# EAGLE schematic PWR1 (EAGLE 4.16)
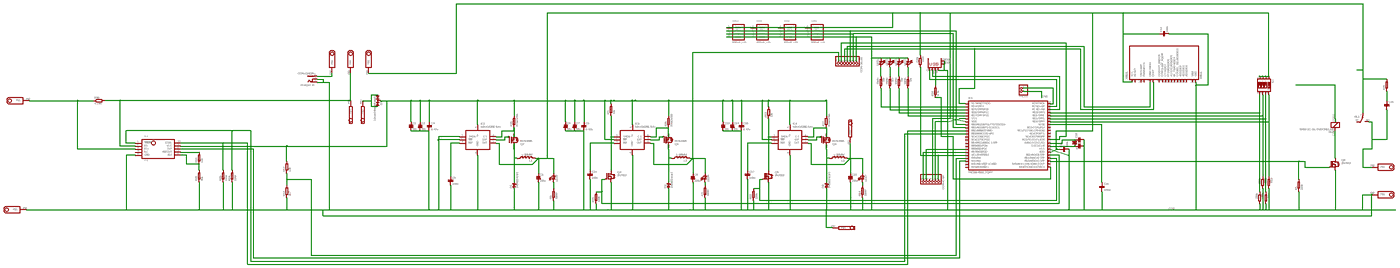
[diagram p0: schematic, sheet 1, overview]
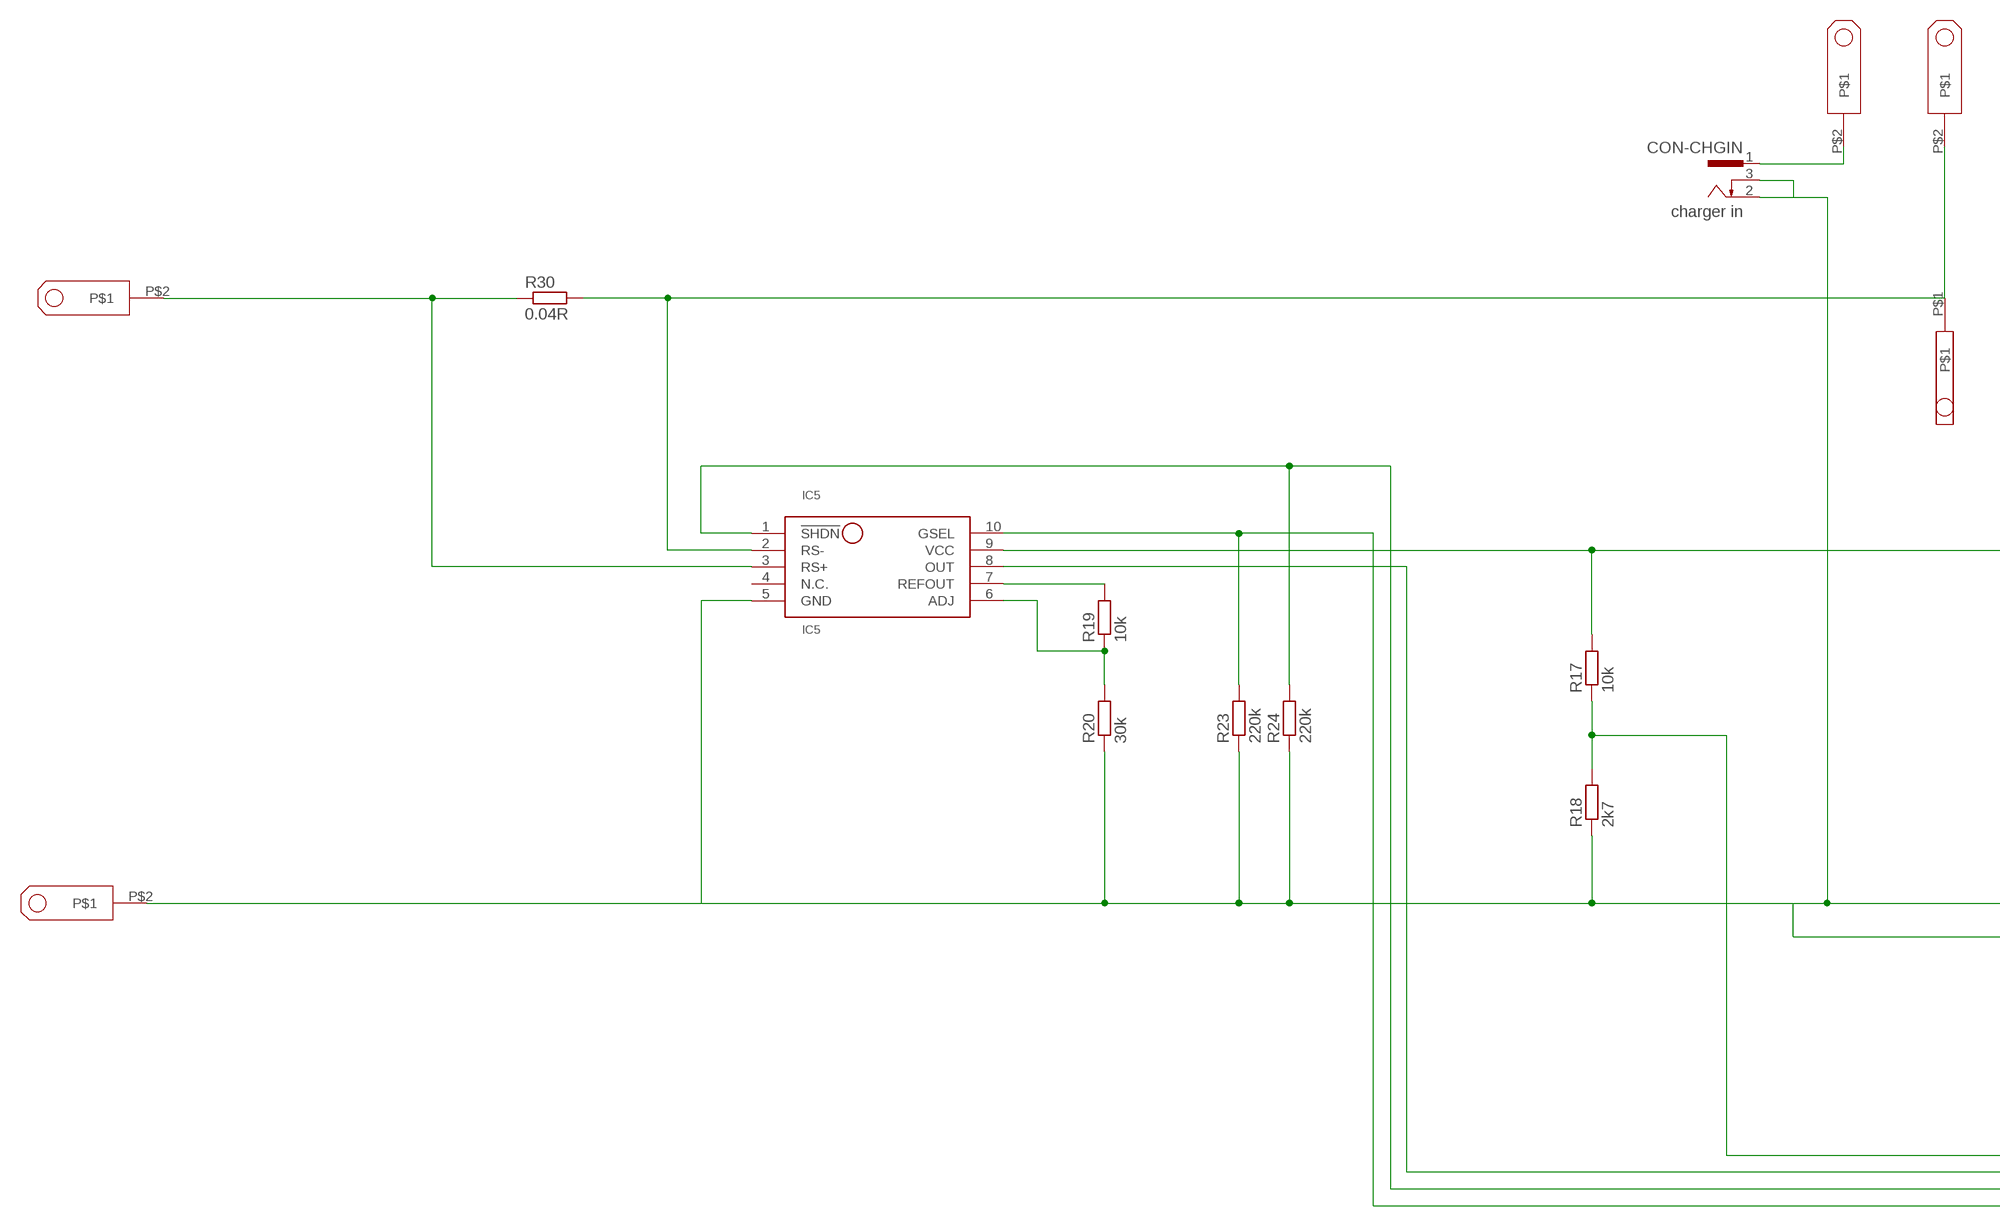
[diagram p1: schematic, sheet 1, part 1 of 4]
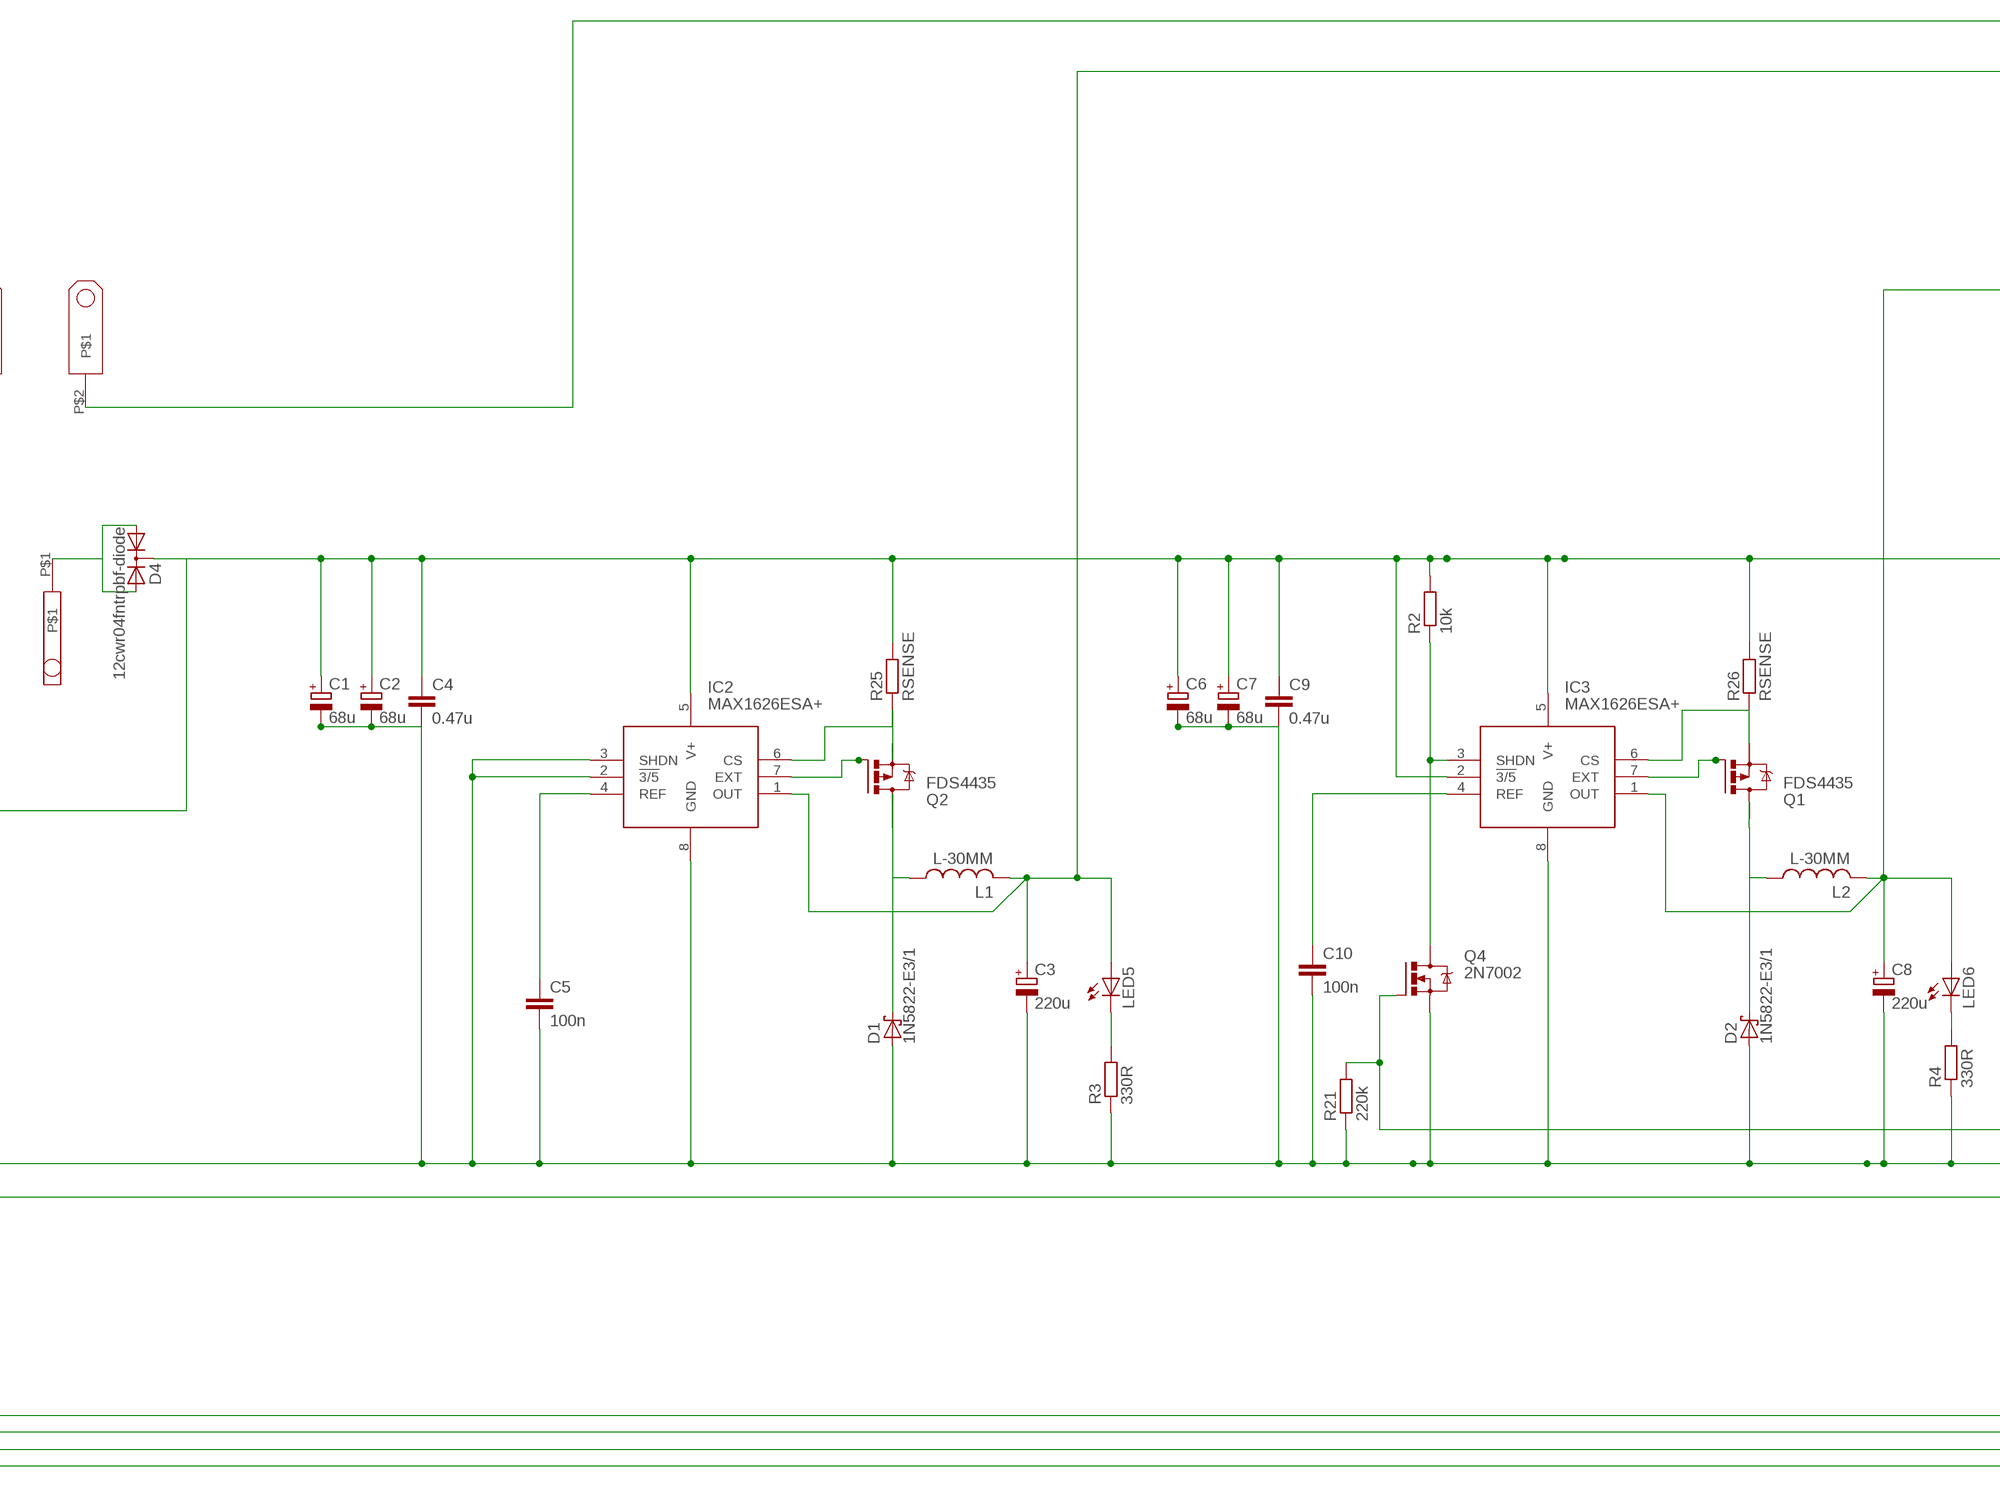
[diagram p2: schematic, sheet 1, part 2 of 4]
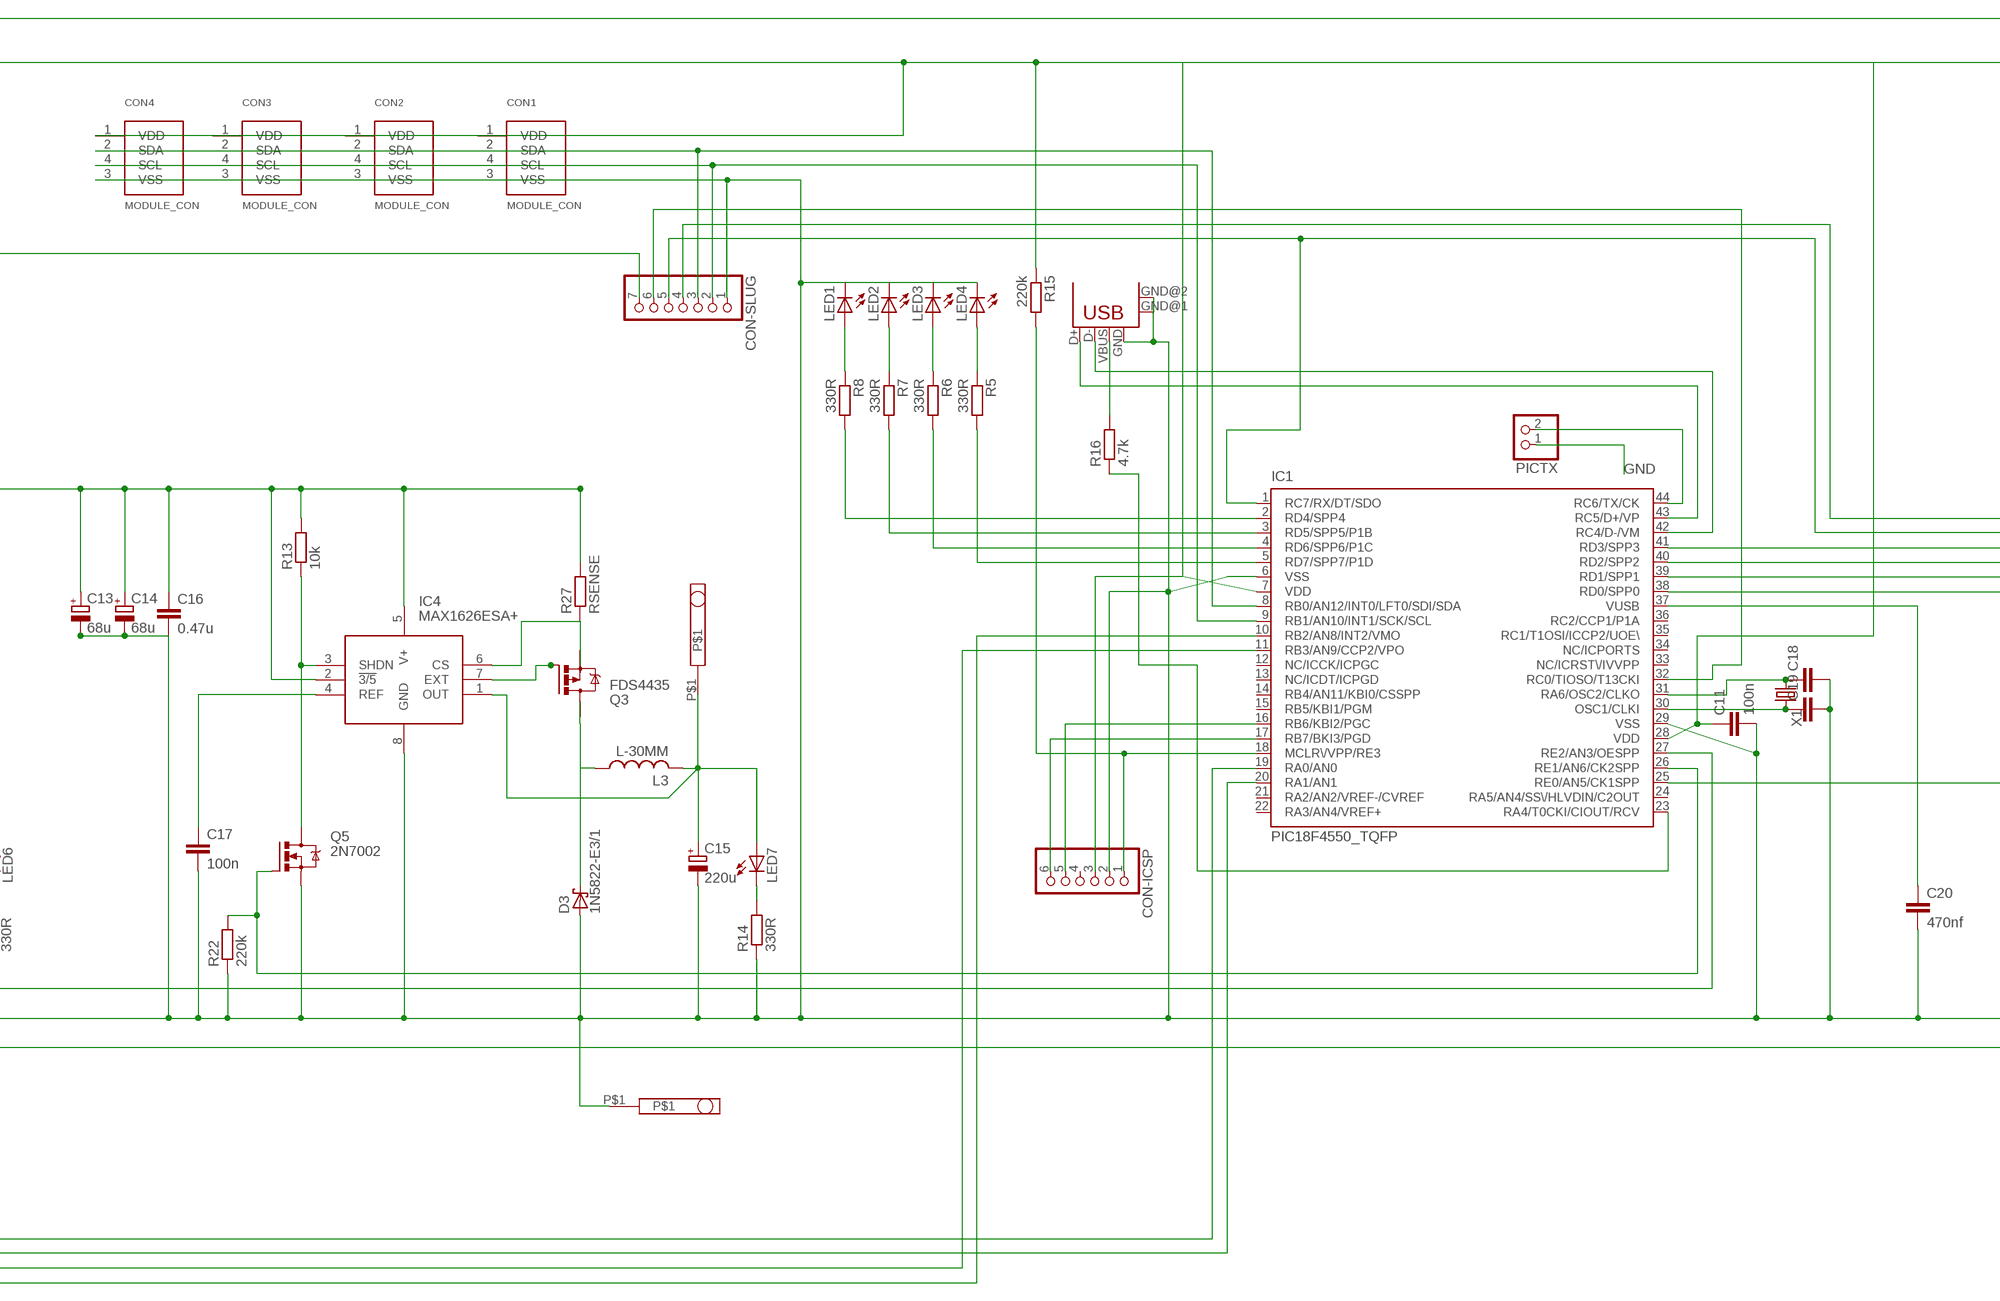
[diagram p3: schematic, sheet 1, part 3 of 4]
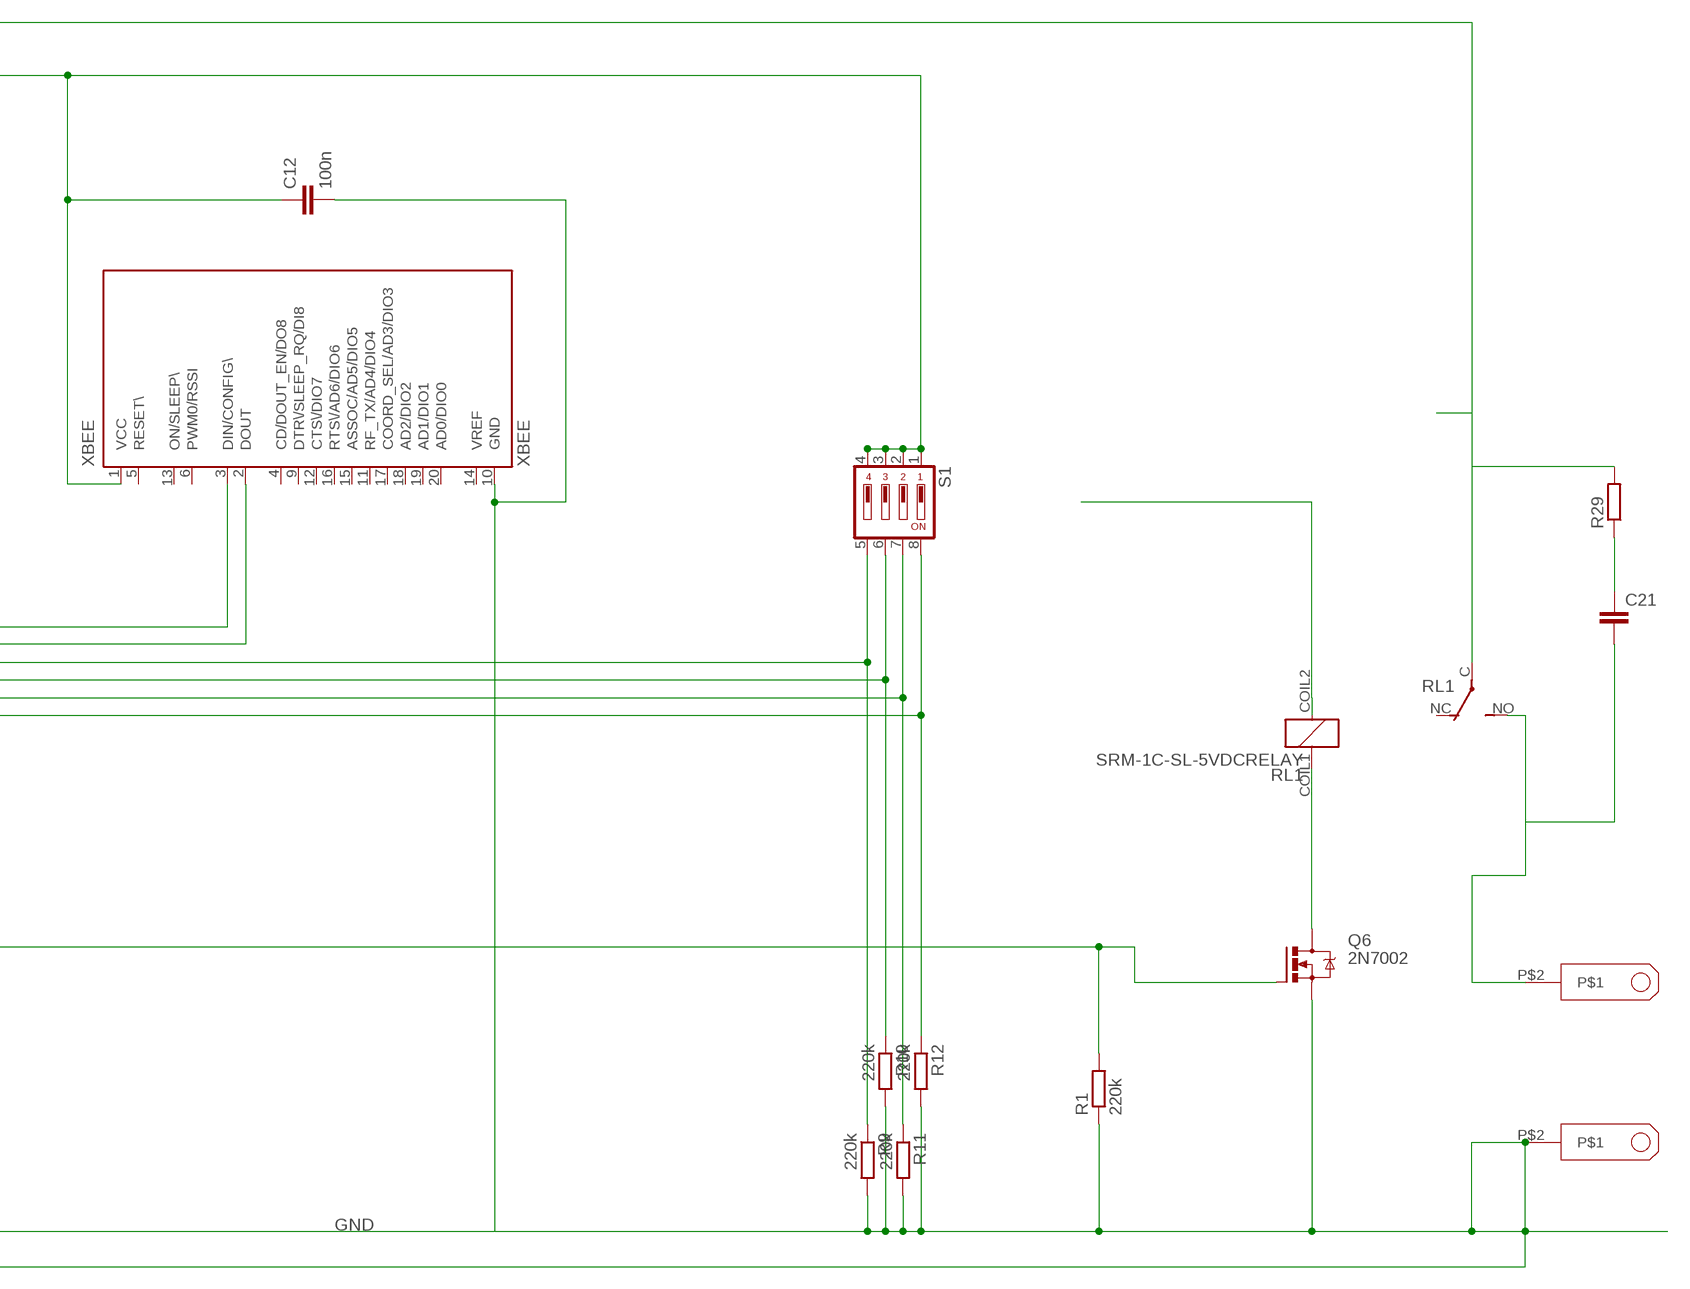
[diagram p4: schematic, sheet 1, part 4 of 4]

## Parts
C1  68u  CPOL-EUE3.5-8  [E3,5-8]
C2  68u  CPOL-EUE3.5-8  [E3,5-8]
C3  220u  CPOL-EUE2.5-6  [E2,5-6]
C4  0.47u  C-EUC0603  [C0603]
C5  100n  C-EUC0603  [C0603]
C6  68u  CPOL-EUE3.5-8  [E3,5-8]
C7  68u  CPOL-EUE3.5-8  [E3,5-8]
C8  220u  CPOL-EUE2.5-6  [E2,5-6]
C9  0.47u  C-EUC0603  [C0603]
C10  100n  C-EUC0603  [C0603]
C11  100n  C-EUC0603  [C0603]
C12  100n  C-EUC0603  [C0603]
C13  68u  CPOL-EUE3.5-8  [E3,5-8]
C14  68u  CPOL-EUE3.5-8  [E3,5-8]
C15  220u  CPOL-EUE2.5-6  [E2,5-6]
C16  0.47u  C-EUC0603  [C0603]
C17  100n  C-EUC0603  [C0603]
C18  C-EUC1206K  [C1206K]
C19  C-EUC1206K  [C1206K]
C20  470nf  C-EUC0603  [C0603]
C21  C-EUC1206  [C1206]
CON1  MODULE_CON  [RJ11-4P4C]
CON2  MODULE_CON  [RJ11-4P4C]
CON3  MODULE_CON  [RJ11-4P4C]
CON4  MODULE_CON  [RJ11-4P4C]
CON-CHGIN  charger in  SCD-014A  [SCD-014-A]
CON-CHRG-CHARGE  6.3X0.8-SPADE  [SPADE]
CON-CHRG-COM  6.3X0.8-SPADE  [SPADE]
CON-CHRG-RUN  6.3X0.8-SPADE  [SPADE]
CON-ICSP  PINHD-1X6  [1X06]
CON-LOGICPWR1  4.8X0.8-SPADE  [SPADE]
CON-LOGICPWR2  4.8X0.8-SPADE  [SPADE]
CON-MOTPWR+  6.3X0.8-SPADE  [SPADE]
CON-MOTPWRGND  6.3X0.8-SPADE  [SPADE]
CON-SERVO+VE  4.8X0.8-SPADE  [SPADE]
CON-SERVO_GND  4.8X0.8-SPADE  [SPADE]
CON-SLUG  PINHD-1X7  [1X07]
CON-USB1  USB-B-H  [USB-B-H]
CON-VBATT+VE  6.3X0.8-SPADE  [SPADE]
CON-VBATT-VE  6.3X0.8-SPADE  [SPADE]
D1  1N5822-E3/1  SCHOTTKY-DIODEDO201T15  [DO201T15]
D2  1N5822-E3/1  SCHOTTKY-DIODEDO201T15  [DO201T15]
D3  1N5822-E3/1  SCHOTTKY-DIODEDO201T15  [DO201T15]
D4  12cwr04fntrpbf-diode  FFB20UP20DN-DIODE  [TO252-3]
IC1  PIC18F4550_TQFP  [TQFP44]
IC2  MAX1626ESA+  [SO04]
IC3  MAX1626ESA+  [SO04]
IC4  MAX1626ESA+  [SO04]
IC5  MAX4069  [UMAX]
L1  L-30MM  [30MMRES]
L2  L-30MM  [30MMRES]
L3  L-30MM  [30MMRES]
LED1  LED3MM  [LED3MM]
LED2  LED3MM  [LED3MM]
LED3  LED3MM  [LED3MM]
LED4  LED3MM  [LED3MM]
LED5  LED3MM  [LED3MM]
LED6  LED3MM  [LED3MM]
LED7  LED3MM  [LED3MM]
PICTX  PINHD-1X2  [1X02]
Q1  FDS4435  P-MOSFET-SO8  [SO-08]
Q2  FDS4435  P-MOSFET-SO8  [SO-08]
Q3  FDS4435  P-MOSFET-SO8  [SO-08]
Q4  2N7002  [SOT23]
Q5  2N7002  [SOT23]
Q6  2N7002  [SOT23]
R1  220k  R-EU_M1206  [M1206]
R2  10k  R-EU_M1206  [M1206]
R3  330R  R-EU_M1206  [M1206]
R4  330R  R-EU_M1206  [M1206]
R5  330R  R-EU_M1206  [M1206]
R6  330R  R-EU_M1206  [M1206]
R7  330R  R-EU_M1206  [M1206]
R8  330R  R-EU_M1206  [M1206]
R9  220k  R-EU_M1206  [M1206]
R10  220k  R-EU_M1206  [M1206]
R11  220k  R-EU_M1206  [M1206]
R12  220k  R-EU_M1206  [M1206]
R13  10k  R-EU_M1206  [M1206]
R14  330R  R-EU_M1206  [M1206]
R15  220k  R-EU_M1206  [M1206]
R16  4.7k  R-EU_M1206  [M1206]
R17  10k  R-EU_M1206  [M1206]
R18  2k7  R-EU_M1206  [M1206]
R19  10k  R-EU_M1206  [M1206]
R20  30k  R-EU_M1206  [M1206]
R21  220k  R-EU_M1206  [M1206]
R22  220k  R-EU_M1206  [M1206]
R23  220k  R-EU_M1206  [M1206]
R24  220k  R-EU_M1206  [M1206]
R25  RSENSE  [PWR-RES]
R26  RSENSE  [PWR-RES]
R27  RSENSE  [PWR-RES]
R29  R-EU_M1206  [M1206]
R30  0.04R  R-EU_R2512  [R2512]
RL1  SRM-1C-SL-5VDCRELAY  [RELAY5PIN]
S1  DP04  [DP-04]
X1  CRYSTALSM49  [SM49]
XBEE  XBEE  [XBEE]

## Nets
5VSERVO: C15.+ CON-SERVO+VE.P$1 IC4.1(OUT) L3.2 LED7.A RL1.COIL2
ADCI: IC1.20(RA1/AN1) IC5.8(OUT)
ADCV: IC1.19(RA0/AN0) R17.1 R18.2
GND: C1.- C2.- C3.- C4.2 C5.2 C6.- C7.- C8.- C9.2 C10.2 C11.2 C12.2 C13.- C14.- C15.- C16.2 C17.2 C18.2 C19.2 C20.2 CON1.3(VSS) CON2.3(VSS) CON3.3(VSS) CON4.3(VSS) CON-CHGIN.2 CON-CHGIN.3 CON-ICSP.2 CON-MOTPWRGND.P$2 CON-SERVO_GND.P$1 CON-SLUG.1 CON-USB1.GND CON-USB1.GND@1(GND) CON-USB1.GND@2(GND) CON-VBATT-VE.P$2 D1.A D2.A D3.A IC1.6(VSS) IC1.29(VSS) IC2.2(!3/5) IC2.3(SHDN) IC2.8(GND) IC3.8(GND) IC4.8(GND) IC5.5(GND) LED1.K(C) LED2.K(C) LED3.K(C) LED4.K(C) PICTX.1 Q4.2(S) Q5.2(S) Q6.2(S) R1.1 R3.1 R4.1 R9.2 R10.2 R11.2 R12.2 R14.1 R18.1 R20.1 R21.1 R22.1 R23.1 R24.1 XBEE.10(GND)
L2: D3.C L3.1 Q3.5(D) Q3.6(D) Q3.7(D) Q3.8(D)
N$1: LED1.A R8.1
N$2: CON-CHRG-COM.P$2 CON-LOGICPWR1.P$1 IC5.2(RS-) R30.2
N$3: Q6.3(D) RL1.COIL1
N$4: LED2.A R7.1
N$5: IC2.6(CS) Q2.1(S) Q2.2(S) Q2.3(S) R25.P$1
N$6: C5.1 IC2.4(REF)
N$7: C21.1 R29.1
N$8: C17.1 IC4.4(REF)
N$10: IC2.7(EXT) Q2.4(G)
N$11: IC4.6(CS) Q3.1(S) Q3.2(S) Q3.3(S) R27.P$1
N$12: C10.1 IC3.4(REF)
N$13: IC3.6(CS) Q1.1(S) Q1.2(S) Q1.3(S) R26.P$1
N$14: CON-LOGICPWR2.P$1 D4.GATE(A1) D4.SOURCE(A2)
N$15: IC3.7(EXT) Q1.4(G)
N$16: LED3.A R6.1
N$17: C21.2 CON-MOTPWR+.P$2 RL1.NO
N$20: IC4.7(EXT) Q3.4(G)
N$21: LED4.A R5.1
N$22: D1.C L1.1 Q2.5(D) Q2.6(D) Q2.7(D) Q2.8(D)
N$23: D2.C L2.1 Q1.5(D) Q1.6(D) Q1.7(D) Q1.8(D)
N$25: IC1.41(RD3/SPP3) R9.1 S1.5
N$26: IC1.40(RD2/SPP2) R10.1 S1.6
N$27: IC1.39(RD1/SPP1) R11.1 S1.7
N$28: IC1.38(RD0/SPP0) R12.1 S1.8
N$29: IC3.3(SHDN) Q4.3(D) R2.1
N$30: LED5.K(C) R3.2
N$31: LED6.K(C) R4.2
N$32: CON-ICSP.1 IC1.18(MCLR\/VPP/RE3) R15.2
N$36: IC4.3(SHDN) Q5.3(D) R13.1
N$37: LED7.K(C) R14.2
N$38: IC1.26(RE1/AN6/CK2SPP) Q5.1(G) R22.2
N$39: CON-VBATT+VE.P$2 IC5.3(RS+) R30.1
N$40: C20.1 IC1.37(VUSB)
N$42: IC1.25(RE0/AN5/CK1SPP) Q6.1(G) R1.2
N$43: IC1.27(RE2/AN3/OESPP) Q4.1(G) R21.2
N$44: IC1.3(RD5/SPP5/P1B) R7.2
N$47: CON-ICSP.5 IC1.16(RB6/KBI2/PGC)
N$48: CON-ICSP.6 IC1.17(RB7/BKI3/PGD)
N$49: CON-USB1.VBUS R16.2
N$50: IC1.2(RD4/SPP4) R8.2
N$51: CON-USB1.D- IC1.42(RC4/D-/VM)
N$52: CON-USB1.D+ IC1.43(RC5/D+/VP)
N$53: IC1.5(RD7/SPP7/P1D) R5.2
N$54: CON-CHGIN.1 CON-CHRG-CHARGE.P$2
N$56: IC5.7(REFOUT) R19.2
N$58: IC5.6(ADJ) R19.1 R20.2
N$61: IC1.11(RB3/AN9/CCP2/VPO) IC5.1(!SHDN) R24.2
N$62: IC1.10(RB2/AN8/INT2/VMO) IC5.10(GSEL) R23.2
N$63: IC1.23(RA4/T0CKI/CIOUT/RCV) R16.1
N$67: C19.1 IC1.30(OSC1/CLKI) X1.2
N$68: C18.1 IC1.31(RA6/OSC2/CLKO) X1.1
N$69: IC1.4(RD6/SPP6/P1C) R6.2
PICTXS: IC1.44(RC6/TX/CK) PICTX.2
RX2PIC: CON-SLUG.5 IC1.1(RC7/RX/DT/SDO) XBEE.2(DOUT)
SCL: CON1.4(SCL) CON2.4(SCL) CON3.4(SCL) CON4.4(SCL) CON-SLUG.2 IC1.9(RB1/AN10/INT1/SCK/SCL)
SDA: CON1.2(SDA) CON2.2(SDA) CON3.2(SDA) CON4.2(SDA) CON-SLUG.3 IC1.8(RB0/AN12/INT0/LFT0/SDI/SDA)
SLUG-BOOT: CON-SLUG.6 IC1.32(RC0/TIOSO/T13CKI)
TX2SLUG: CON-SLUG.4 XBEE.3(DIN/CONFIG\)
VLOGICRAW: C1.+ C2.+ C4.1 C6.+ C7.+ C9.1 C13.+ C14.+ C16.1 D4.DRAIN(C) IC2.5(V+) IC3.2(!3/5) IC3.5(V+) IC4.2(!3/5) IC4.5(V+) IC5.9(VCC) R2.2 R13.2 R17.2 R25.P$2 R26.P$2 R27.P$2
VRAW: CON-CHRG-RUN.P$2 R29.2 RL1.C
VREG3.3: C3.+ C11.1 C12.1 CON1.1(VDD) CON2.1(VDD) CON3.1(VDD) CON4.1(VDD) CON-ICSP.3 IC1.7(VDD) IC1.28(VDD) IC2.1(OUT) L1.2 LED5.A R15.1 S1.1 S1.2 S1.3 S1.4 XBEE.1(VCC)
VREGSLUG5: C8.+ CON-SLUG.7 IC3.1(OUT) L2.2 LED6.A
Unconnected: CON-ICSP.4 IC1.12(NC/ICCK/ICPGC) IC1.13(NC/ICDT/ICPGD) IC1.14(RB4/AN11/KBI0/CSSPP) IC1.15(RB5/KBI1/PGM) IC1.21(RA2/AN2/VREF-/CVREF) IC1.22(RA3/AN4/VREF+) IC1.24(RA5/AN4/SS\/HLVDIN/C2OUT) IC1.33(NC/ICRST\/IVVPP) IC1.34(NC/ICPORTS) IC1.35(RC1/T1OSI/ICCP2/UOE\) IC1.36(RC2/CCP1/P1A) RL1.NC XBEE.4(CD/DOUT_EN/DO8) XBEE.5(RESET\) XBEE.6(PWM0/RSSI) XBEE.9(DTR\/SLEEP_RQ/DI8) XBEE.11(RF_TX/AD4/DIO4) XBEE.12(CTS\/DIO7) XBEE.13(ON/SLEEP\) XBEE.14(VREF) XBEE.15(ASSOC/AD5/DIO5) XBEE.16(RTS\/AD6/DIO6) XBEE.17(COORD_SEL/AD3/DIO3) XBEE.18(AD2/DIO2) XBEE.19(AD1/DIO1) XBEE.20(AD0/DIO0)

## Power pins joined to a net without a drawn wire
N.C.: IC5.4(N.C.)

## Library data of the parts
C1-C3 C6-C8 C13-C15 = rcl:CPOL-EU: POLARIZED CAPACITOR, European symbol
C4 C5 C9-C12 C16-C21 = rcl:C-EU: CAPACITOR, European symbol
CON1-CON4 = ecssr:MODULE_CON
CON-CHGIN = con-shiua-chyuan:SCD-014A: Power Jack 2.5mm
CON-CHRG-CHARGE CON-CHRG-COM CON-CHRG-RUN CON-MOTPWR+ CON-MOTPWRGND CON-VBATT+VE CON-VBATT-VE = ecssr-Pwr:6.3X0.8-SPADE
CON-ICSP = pinhead:PINHD-1X6: PIN HEADER
CON-LOGICPWR1 CON-LOGICPWR2 CON-SERVO+VE CON-SERVO_GND = ecssr-Pwr:4.8X0.8-SPADE
CON-SLUG = pinhead:PINHD-1X7: PIN HEADER
CON-USB1 = con-usb-2:USB: USB Connectors
D1-D3 = diode:SCHOTTKY-DIODE: Schottky Diode
D4 = ecssr-Pwr:FFB20UP20DN-DIODE
IC1 = microchip:PIC18F4*_TQFP: USB Microcontrollers with nanoWatt Technology High-Performance, Enhanced Flash, 28/40/44-Pin, Source: http://ww1.microchip.com/downloads/en/devicedoc/39632c.pdf
IC2-IC4 = ecssr-Pwr:MAX1626ESA+
IC5 = ecssr-Pwr:MAX4069
L1-L3 = ecssr-Pwr:L-30MM
LED1-LED7 = led:LED: LED OSRAM: - CHIPLED LG R971, LG N971, LY N971, LG Q971, LY Q971, LO R971, LY R971 LH N974, LH R974 LS Q976, LO Q976, LY Q976 LO Q996 - Hyper CHIPLED LW Q18S LB Q993, LB Q99A, LB R99A - SideLED LS A670, LO A670, LY A670, LG A670, LP A670 LB A673, LV A673, LT A673, LW A673 LH A674 LY A675 LS A676, LA A676, LO A676, LY A676, LW A676 LS A679, LY A679, LG A679 - Hyper Micro SIDELED® LS Y876, LA Y876, LO Y876, LY Y876 LT Y87S - SmartLED LW L88C, LW L88S LB L89C, LB L89S, LG L890 LS L89K, LO L89K, LY L89K LS L896, LA L896, LO L896, LY L896 - TOPLED LS T670, LO T670, LY T670, LG T670, LP T670 LSG T670, LSP T670, LSY T670, LOP T670, LYG T670 LG T671, LOG T671, LSG T671 LB T673, LV T673, LT T673, LW T673 LH T674 LS T676, LA T676, LO T676, LY T676, LB T676, LH T676, LSB T676, LW T676 LB T67C, LV T67C, LT T67C, LS T67K, LO T67K, LY T67K, LW E67C LS E67B, LA E67B, LO E67B, LY E67B, LB E67C, LV E67C, LT E67C LW T67C LS T679, LY T679, LG T679 LS T770, LO T770, LY T770, LG T770, LP T770 LB T773, LV T773, LT T773, LW T773 LH T774 LS E675, LA E675, LY E675, LS T675 LS T776, LA T776, LO T776, LY T776, LB T776 LHGB T686 LT T68C, LB T68C - Hyper Mini TOPLED® LB M676 - Mini TOPLED Santana® LG M470 LS M47K, LO M47K, LY M47K Source: http://www.osram.convergy.de - LUMILED® LXK2-PW12-R00, LXK2-PW12-S00, LXK2-PW14-U00, LXK2-PW14-V00 LXK2-PM12-R00, LXK2-PM12-S00, LXK2-PM14-U00 LXK2-PE12-Q00, LXK2-PE12-R00, LXK2-PE12-S00, LXK2-PE14-T00, LXK2-PE14-U00 LXK2-PB12-K00, LXK2-PB12-L00, LXK2-PB12-M00, LXK2-PB14-N00, LXK2-PB14-P00, LXK2-PB14-Q00 LXK2-PR12-L00, LXK2-PR12-M00, LXK2-PR14-Q00, LXK2-PR14-R00 LXK2-PD12-Q00, LXK2-PD12-R00, LXK2-PD12-S00 LXK2-PH12-R00, LXK2-PH12-S00 LXK2-PL12-P00, LXK2-PL12-Q00, LXK2-PL12-R00 Source: www.luxeon.com
PICTX = pinhead:PINHD-1X2: PIN HEADER
Q1-Q3 = transistor-power:P-MOSFET-SO8: P-Channel MOSFET Example: FDS4435A; P-Channel Logic Level PowerTrench® MOSFET FDS4465; P-Channel 1.8V Specified PowerTrench® MOSFET Source: www.fairchildsemi.com
Q4-Q6 = ecssr:2N7002
R1-R24 R29 R30 = rcl:R-EU_: RESISTOR, European symbol
R25-R27 = ecssr-Pwr:RSENSE
RL1 = ecssr-Pwr:SRM-1C-SL-5VDCRELAY
S1 = switch-dil:DP04: DIL/CODE SWITCH
X1 = crystal:CRYSTAL: CRYSTAL
XBEE = ecssr-Pwr:XBEE: XBee (TM) /XBee-PRO(TM) OEM RF Modules Source: MaxStream, Inc. xbee_productmanual.pdf